# Altium schematic sheet PWM_Controller.SchDoc
size A4
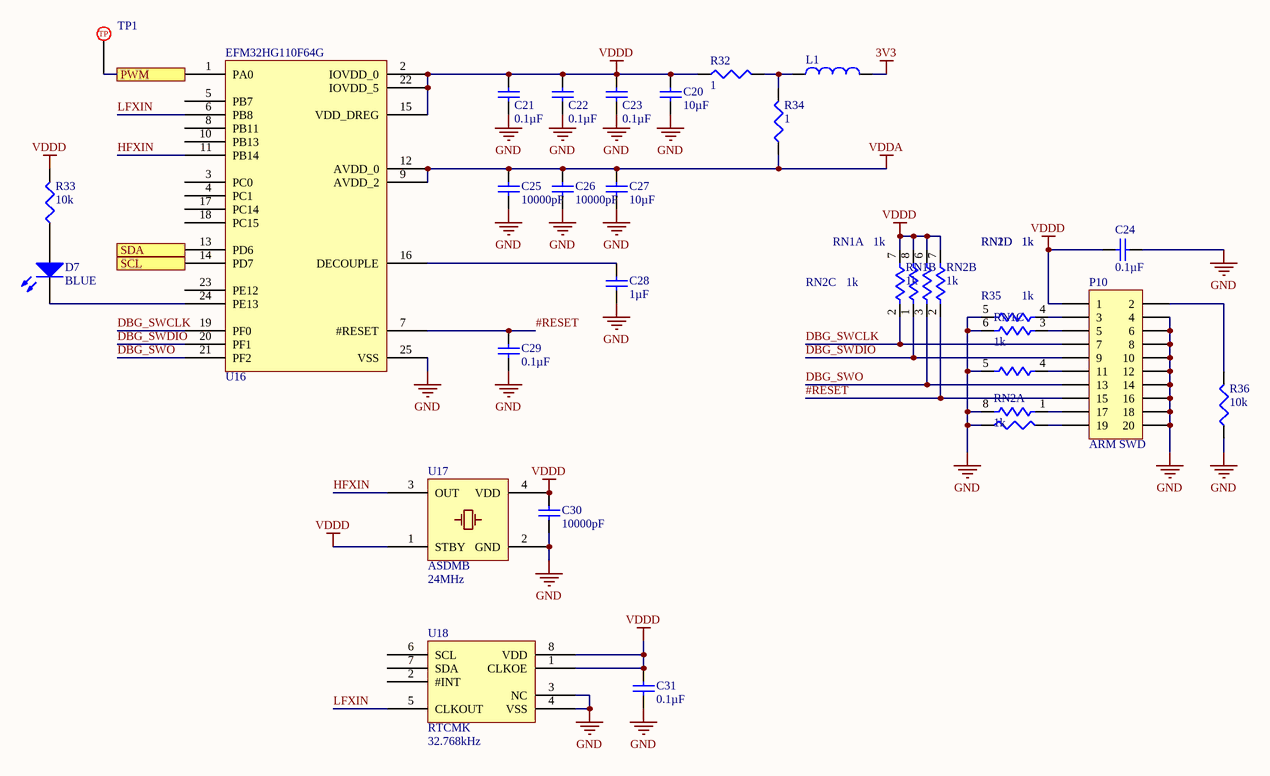
[diagram p0: PWM_Controller.SchDoc]

## Parts
C20  value 10µF  [TDK-CGA5L]  (hidden comment: Cap)
C21  value 0.1µF  [TDK-CGA3E]  (hidden comment: Cap)
C22  value 0.1µF  [TDK-CGA3E]  (hidden comment: Cap)
C23  value 0.1µF  [TDK-CGA3E]  (hidden comment: Cap)
C24  value 0.1µF  [TDK-CGA3E]  (hidden comment: Cap)
C25  value 10000pF  [TDK-CGA3E]  (hidden comment: Cap)
C26  value 10000pF  [TDK-CGA3E]  (hidden comment: Cap)
C27  value 10µF  [TDK-CGA5L]  (hidden comment: Cap)
C28  value 1µF  [TDK-CGA3E]  (hidden comment: Cap)
C29  value 0.1µF  [TDK-CGA3E]  (hidden comment: Cap)
C30  value 10000pF  [TDK-CGA3E]  (hidden comment: Cap)
C31  value 0.1µF  [TDK-CGA3E]  (hidden comment: Cap)
D7  value BLUE  [WL-150060XS75000]  (hidden comment: LED)
L1  Inductor  [TDK-MPX1608]  (value not drawn)
P10  Header 10x2  [SLN-GRPB102]  (value not drawn)
R32  value 1  [VSH-0603MCT]  (hidden comment: Res3)
R33  value 10k  [PANA-ERJ3EK]  (hidden comment: Res3)
R34  value 1  [VSH-0603MCT]  (hidden comment: Res3)
R35  value 1k  [PANA-ERJ3EK]  (hidden comment: Res3)
R36  value 10k  [PANA-ERJ3EK]  (hidden comment: Res3)
RN1  value 1k  [PANA-EXB1206]  (hidden comment: Res4 Pack1)  (parts A,B,C,D of 4)
RN2  value 1k  [PANA-EXB1206]  (hidden comment: Res4 Pack1)  (parts A,B,C,D of 4)
TP1  5017  [KS-5017]  (value not drawn)
U16  EFM32HG110F64G  [SI-QFN24]
U17  ASDMB  value 24MHz  [ABR-ASDMB]
U18  RTCMK  value 32.768kHz  [ABR-RTCMK]

## Ports
PWM, SCL, SDA

## Nets
3V3: L1.2
GND: C20.1 C21.1 C22.1 C23.1 C24.2 C25.1 C26.1 C27.1 C28.1 C29.2 C30.1 C31.1 P10.4 P10.6 P10.8 P10.10 P10.12 P10.14 P10.16 P10.18 P10.20 R35.2 R36.1 RN1.5 RN1.6 RN2.5 RN2.8 U16.25(VSS) U17.2(GND) U18.3(NC) U18.4(VSS)
VDDA: C25.2 C26.2 C27.2 R34.1 U16.9(AVDD_2) U16.12(AVDD_0)
VDDD: C20.2 C21.2 C22.2 C23.2 C24.1 C30.2 C31.2 P10.1 R32.2 R33.2 RN1.7 RN1.8 RN2.6 RN2.7 U16.2(IOVDD_0) U16.15(VDD_DREG) U16.22(IOVDD_5) U17.1(STBY) U17.4(VDD) U18.1(CLKOE) U18.8(VDD)
#RESET: C29.1 P10.15 RN2.2 U16.7(#RESET)
DBG_SWCLK: P10.7 RN1.2 U16.19(PF0)
DBG_SWDIO: P10.9 RN1.1 U16.20(PF1)
DBG_SWO: P10.13 RN2.3 U16.21(PF2)
HFXIN: U16.11(PB14) U17.3(OUT)
LFXIN: U16.6(PB8) U18.5(CLKOUT)
PWM: TP1.1 U16.1(PA0) ; port PWM
SCL: U16.14(PD7) ; port SCL
SDA: U16.13(PD6) ; port SDA
NetC28_2: C28.2 U16.16(DECOUPLE)
NetD7_1: D7.1(A) R33.1
NetD7_2: D7.2(K) U16.24(PE13)
NetL1_1: L1.1 R32.1 R34.2
NetP10_2: P10.2 R36.2
NetP10_3: P10.3 RN1.4
NetP10_5: P10.5 RN1.3
NetP10_11: P10.11 RN2.4
NetP10_17: P10.17 RN2.1
NetP10_19: P10.19 R35.1

Not connected (* = marked no-connect by the designer): U16 3(PC0) 4(PC1) 5(PB7) 8(PB11) 10(PB13) 17(PC14) 18(PC15) 23(PE12); U18 2(#INT) 6(SCL) 7(SDA)

## Notes on the sheet
- (near P10) ARM SWD
- (in symbol PTP-KS-00001) TP

## Library data of the parts
C20 C27 = PC-TDK-02917: CAP CER 10UF 25V X7R 1206; Manufacturer Part Number: CGA5L1X7R1E106K160AC; Index: 2917; Tolerance: ±10%; Published: 3/16/2016; LatestRevisionDate: 3/16/2016; LatestRevisionNote: ...; PackageReference: 1206 (3216 Metric); Publisher: AlbertaSat; PackageDescription: Radial Cap, Thru-Hole; 2 Leads; 0.3 in Pin Spacing; Part Number: PC-TDK-02917; Supplier Part Number 1: 445-6990-1-ND; Supplier 1: Digi-key; Supplier Link: http://www.digikey.ca/product-search/en?keywords=445-6990-1-ND; Voltage - Rated: 25V; Temperature Coefficient: X7R; Applications: Automotive
C21-C24 C29 C31 = PC-TDK-02272: CAP CER 0.1UF 50V X8R 0603; Manufacturer Part Number: CGA3E3X8R1H104K080AB; Index: 2272; Tolerance: ±10%; Published: 3/16/2016; LatestRevisionDate: 3/16/2016; LatestRevisionNote: ...; PackageReference: 0603 (1608 Metric); Publisher: AlbertaSat; PackageDescription: Radial Cap, Thru-Hole; 2 Leads; 0.3 in Pin Spacing; Part Number: PC-TDK-02272; Supplier Part Number 1: 445-12606-1-ND; Supplier 1: Digi-key; Supplier Link: http://www.digikey.ca/product-search/en?keywords=445-12606-1-ND; Voltage - Rated: 50V; Temperature Coefficient: X8R; Applications: Automotive
C25 C26 C30 = PC-TDK-01883: CAP CER 10000PF 100V C0G 0603; Manufacturer Part Number: CGA3E1C0G2A103J080AC; Index: 1883; Designator: C?; Tolerance: ±5%; Temperature Coefficient: NP0; Published: 3/16/2016; LatestRevisionDate: 3/16/2016; LatestRevisionNote: ...; PackageReference: 0603 (1608 Metric); Publisher: AlbertaSat; PackageDescription: Radial Cap, Thru-Hole; 2 Leads; 0.3 in Pin Spacing; Part Number: PC-TDK-01883; Supplier Part Number 1: 445-172688-1-ND; Supplier 1: Digi-key; Supplier Link: http://www.digikey.ca/product-search/en?keywords=445-172688-1-ND; Voltage - Rated: 100V; Applications: Automotive
C28 = PC-TDK-02603: CAP CER 1UF 25V X7R 0603; Manufacturer Part Number: CGA3E1X7R1E105K080AC; Index: 2603; Designator: C?; Tolerance: ±10%; Published: 3/16/2016; LatestRevisionDate: 3/16/2016; LatestRevisionNote: ...; PackageReference: 0603 (1608 Metric); Publisher: AlbertaSat; PackageDescription: Radial Cap, Thru-Hole; 2 Leads; 0.3 in Pin Spacing; Part Number: PC-TDK-02603; Supplier Part Number 1: 445-6931-1-ND; Supplier 1: Digi-key; Supplier Link: http://www.digikey.ca/product-search/en?keywords=445-6931-1-ND; Voltage - Rated: 25V; Temperature Coefficient: X7R; Applications: Automotive
D7 = 4: LED BLUE CLEAR 0603 SMD; Part Number: 4; Manufacturer Part Number: 150060BS75000; Designator: D?; Brightness: 145mcd; Published: 8-Jun-2000; LatestRevisionDate: 08-Jul-2005; LatestRevisionNote: Mech Layer 1 removed.; PackageReference: WL-150060XS75000; Publisher: Altium Limited; PackageDescription: LED; 2 Leads; Supplier Part Number 1: 732-4966-1-ND; Supplier 1: Digi-Key; Supplier Link: http://www.digikey.ca/product-search/en?keywords=732-4966-1-ND
L1 = PL-TDK-02954: FERRITE BEAD 1 KOHM 0603 1LN; Manufacturer Part Number: MPZ1608S102ATD25; Code_IEC: 1608; Value: 1 kOhm @ 100MHz; Index: 2954; Designator: L?; Current - Rated: 800mA; Published: 7/8/2017; LatestRevisionDate: 7/8/2017; LatestRevisionNote: ...; PackageReference: 0603 (1608 Metric); Publisher: AlbertaSat; PackageDescription: Chip Inductor, 2-Leads, Body 1.60x0.80mm, IPC Low Density; Code_JEITA: 0603; Part Number: PL-TDK-02954; Supplier Part Number 1: 445-172890-1-ND; Supplier 1: Digi-key; Supplier Part Number 2: 810-MPZ1608S102ATD25; Supplier 2: Mouser; Supplier Link: #https://www.digikey.ca/product-detail/en/tdk-corporation/MPZ1608S102ATD25/445-172890-1-ND/5040521#; Applications: Automotive
P10 = PP-SLN-00022: CONN HEADER .050"" 20PS DL PCB AU; Manufacturer Part Number: GRPB102VWVN-RC; Index: 22; Designator: P?; Number of Positions: 20; LatestRevisionDate: 3/16/2016; LatestRevisionNote: ...; Publisher: AlbertaSat; Part Number: PP-SLN-00022; Supplier Part Number 1: S9015E-10-ND; Supplier 1: Digi-key; Published: 3/16/2016; PackageReference: SLN-GRPB102; PackageDescription: CONN HEADER .050"" 20PS DL PCB AU; Supplier Link: http://www.digikey.ca/product-search/en?keywords=S9015E-10-ND; Number of Rows: 2
R32 R34 = PR-VSH-00048: RES SMD 1 OHM 1% 1/8W 0603; Manufacturer Part Number: MCT06030C1008FP500; Index: 4; Designator: R?; Temperature Coefficient: ±50ppm/°C; Published: 3/14/2016; LatestRevisionDate: 3/14/2016; LatestRevisionNote: ...; PackageReference: 0603 (1608 Metric); Publisher: AlbertaSat; PackageDescription: Chip Resistor, 2-Leads, Body 1.55x0.85mm, IPC Low Density; Part Number: PR-VSH-00048; Supplier Part Number 1: MCT0603-1.00-CFCT-ND; Supplier 1: Digi-key; Supplier Link: http://www.digikey.ca/product-search/en?keywords=MCT0603-1.00-CFCT-ND; Tolerance: ±1%; Power - Rated: 1/8W; Applications: General Purpose
R33 R36 = 17203: RES SMD 10K OHM 1% 1/10W 0603; Part Number: 17203; Manufacturer Part Number: ERJ-3EKF1002V; Designator: R?; Power: 0.1W, 1/10W; Temperature Coefficient: ±100ppm/°C; Published: 8-Jun-2000; LatestRevisionDate: 29-May-2009; LatestRevisionNote: IPC-7351 Footprint Added.; PackageReference: 0603 (1608 Metric); Publisher: Altium Limited; PackageDescription: Chip Resistor, 2-Leads, Body 1.60x0.80mm, IPC Low Density; Supplier Part Number 1: P10.0KHCT-ND; Supplier 1: Digi-Key; Supplier Link: http://www.digikey.ca/product-search/en?keywords=P10.0KHCT-ND; Tolerance: ±1%
R35 = 15398: RES SMD 1K OHM 1% 1/10W 0603; Part Number: 15398; Manufacturer Part Number: ERJ-3EKF1001V; Designator: R?; Power: 0.1W, 1/10W; Temperature Coefficient: ±100ppm/°C; Published: 8-Jun-2000; LatestRevisionDate: 29-May-2009; LatestRevisionNote: IPC-7351 Footprint Added.; PackageReference: 0603 (1608 Metric); Publisher: Altium Limited; PackageDescription: Chip Resistor, 2-Leads, Body 1.60x0.80mm, IPC Low Density; Supplier Part Number 1: P1.00KHCT-ND; Supplier 1: Digi-Key; Supplier Link: http://www.digikey.ca/product-search/en?keywords=P1.00KHCT-ND; Tolerance: ±1%
RN1 RN2 = 19830: RES ARRAY 4 RES 1K OHM 1206; Part Number: 19830; Manufacturer Part Number: EXB-38V102JV; Sim Note: Enter the Resistance value into parameter field.; Designator: RN?; Tolerance: ±5%; Power: 62.5mW; Temperature Coefficient: ±200ppm/°C; Code_JEDEC: MS-012-AC; Supplier Part Number 1: Y9102CT-ND; Supplier 1: Digi-Key; Supplier Link: http://www.digikey.ca/product-search/en?keywords=Y9102CT-ND; PackageReference: 1206 (3216 Metric), Convex, Long Side Terminals; PackageDescription: Chip Array, ConvexS, 8-Leads, Pitch 0.80mm,  Body 3.20x1.60mm,  IPC Low Density
TP1 = PTP-KS-00001: PC TEST POINT MINI SMD; Index: 1; Designator: TP?; Part Number: PTP-KS-00001; Manufacturer Part Number: 5017; Supplier Part Number 1: 36-5017CT-ND; Supplier 1: Digi-key; Publisher: AlbertaSat; Published: 3/15/2016; LatestRevisionDate: 3/15/2016; LatestRevisionNote: ...; PackageReference: KS-5017; PackageDescription: Testpoint Lug Mini SMD 27X10X152; Supplier Link: #http://www.digikey.ca/product-detail/en/keystone-electronics/5017/36-5017TR-ND/2217304#
U16 = PU-SI-00016: EFM32HG110F64G-B-QFN24; Index: 16; Designator: U?; Core Processor: ARM Cortex-M0+; Core Size: 32-Bit; Speed: 25MHz; Program Memory Size: 64KB (64K x 8); RAM Size: 8K x 8; Part Number: PU-SI-00016; Manufacturer Part Number: EFM32HG110F64G-B-QFN24; Supplier Part Number 1: 336-3848-ND; Supplier 1: Digi-key; Supplier Part Number 2: 634-HG110F64GBQFN24; Supplier 2: Mouser; Publisher: AlbertaSat; Published: 2018-05-01; LatestRevisionDate: 2018-05-01; LatestRevisionNote: ...; PackageReference: SI-QFN24; PackageDescription: QFN, 24-Leads, Body 5.00x5.00mm, Pitch 0.65mm/0.64mm, Thermal Pad 3.60x3.60mm, IPC Low Density; Supplier Link: #https://www.digikey.ca/product-detail/en/silicon-labs/EFM32HG110F64G-B-QFN24/336-3848-ND/6564870#; Applications: General Purpose; Operating Temperature: -40°C ~ 85°C (TA)
U17 = PU-ABR-00018: OSC MEMS 24.000MHZ CMOS SMD; Manufacturer Part Number: ASDMB-24.000MHZ-XY-T; Index: 18; Designator: U?; Tolerance: ±10ppm; Part Number: PU-ABR-00018; Supplier Part Number 1: 535-11155-1-ND; Supplier 1: Digi-key; Supplier Part Number 2: 815-ASDMB-24-XY-T; Supplier 2: Mouser; Publisher: AlbertaSat; Published: 2017-10-24; LatestRevisionDate: 2017-10-24; LatestRevisionNote: ...; PackageReference: 4-SMD, No Lead; PackageDescription: DFN, 4-Leads, Body 2.00x2.50mm, Pitch 1.65mm, IPC Low Density; Supplier Link: http://www.digikey.ca/product-search/en?keywords=535-11155-1-ND
U18 = PU-ABR-00037: IC RTC CLK/CALENDAR I2C 8-SMT; Manufacturer Part Number: AB-RTCMK-32.768KHZ-T3; Index: 37; Designator: U?; Part Number: PU-ABR-00037; Supplier Part Number 1: 535-11916-1-ND; Supplier 1: Digi-key; Supplier Part Number 2: 815-AB-RTCMK-32.7KT3; Supplier 2: Mouser; Publisher: AlbertaSat; Published: 4/23/2018; LatestRevisionDate: 4/23/2018; LatestRevisionNote: ...; PackageReference: 8-SMD Module; PackageDescription: 8-SMD Module; Supplier Link: https://www.digikey.ca/product-detail/en/abracon-llc/AB-RTCMK-32.768KHZ-T3/535-11916-1-ND/3601050